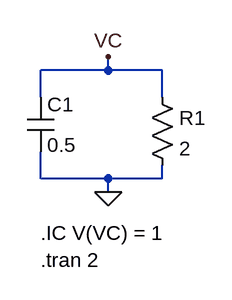
[diagram p0: schematic RC_Schaltkreis.asc]
RC_Schaltkreis.asc, the LTspice schematic file:
Version 4
SHEET 1 880 680
WIRE 320 256 320 240
WIRE 320 256 240 256
WIRE 384 256 320 256
WIRE 240 288 240 256
WIRE 384 288 384 256
WIRE 240 384 240 352
WIRE 320 384 240 384
WIRE 384 384 384 368
WIRE 384 384 320 384
WIRE 320 400 320 384
FLAG 320 400 0
FLAG 320 240 VC
SYMBOL cap 224 288 R0
SYMATTR InstName C1
SYMATTR Value 0.5
SYMBOL Res 368 272 R0
SYMATTR InstName R1
SYMATTR Value 2
TEXT 240 448 Left 2 !.IC V(VC) = 1
TEXT 240 480 Left 2 !.tran 2

The netlist it stands for:
* RC_Schaltkreis.asc
C1 VC 0 0.5
R1 VC 0 2
.IC V(VC) = 1
.tran 2
.backanno
.end